# Altium schematic sheet 15-StimChannelSelection.SchDoc: Output Multiplexing
size A3; Date: 29/12/2023; DocumentNumber: 15; SheetNumber: 15; SheetTotal: 15
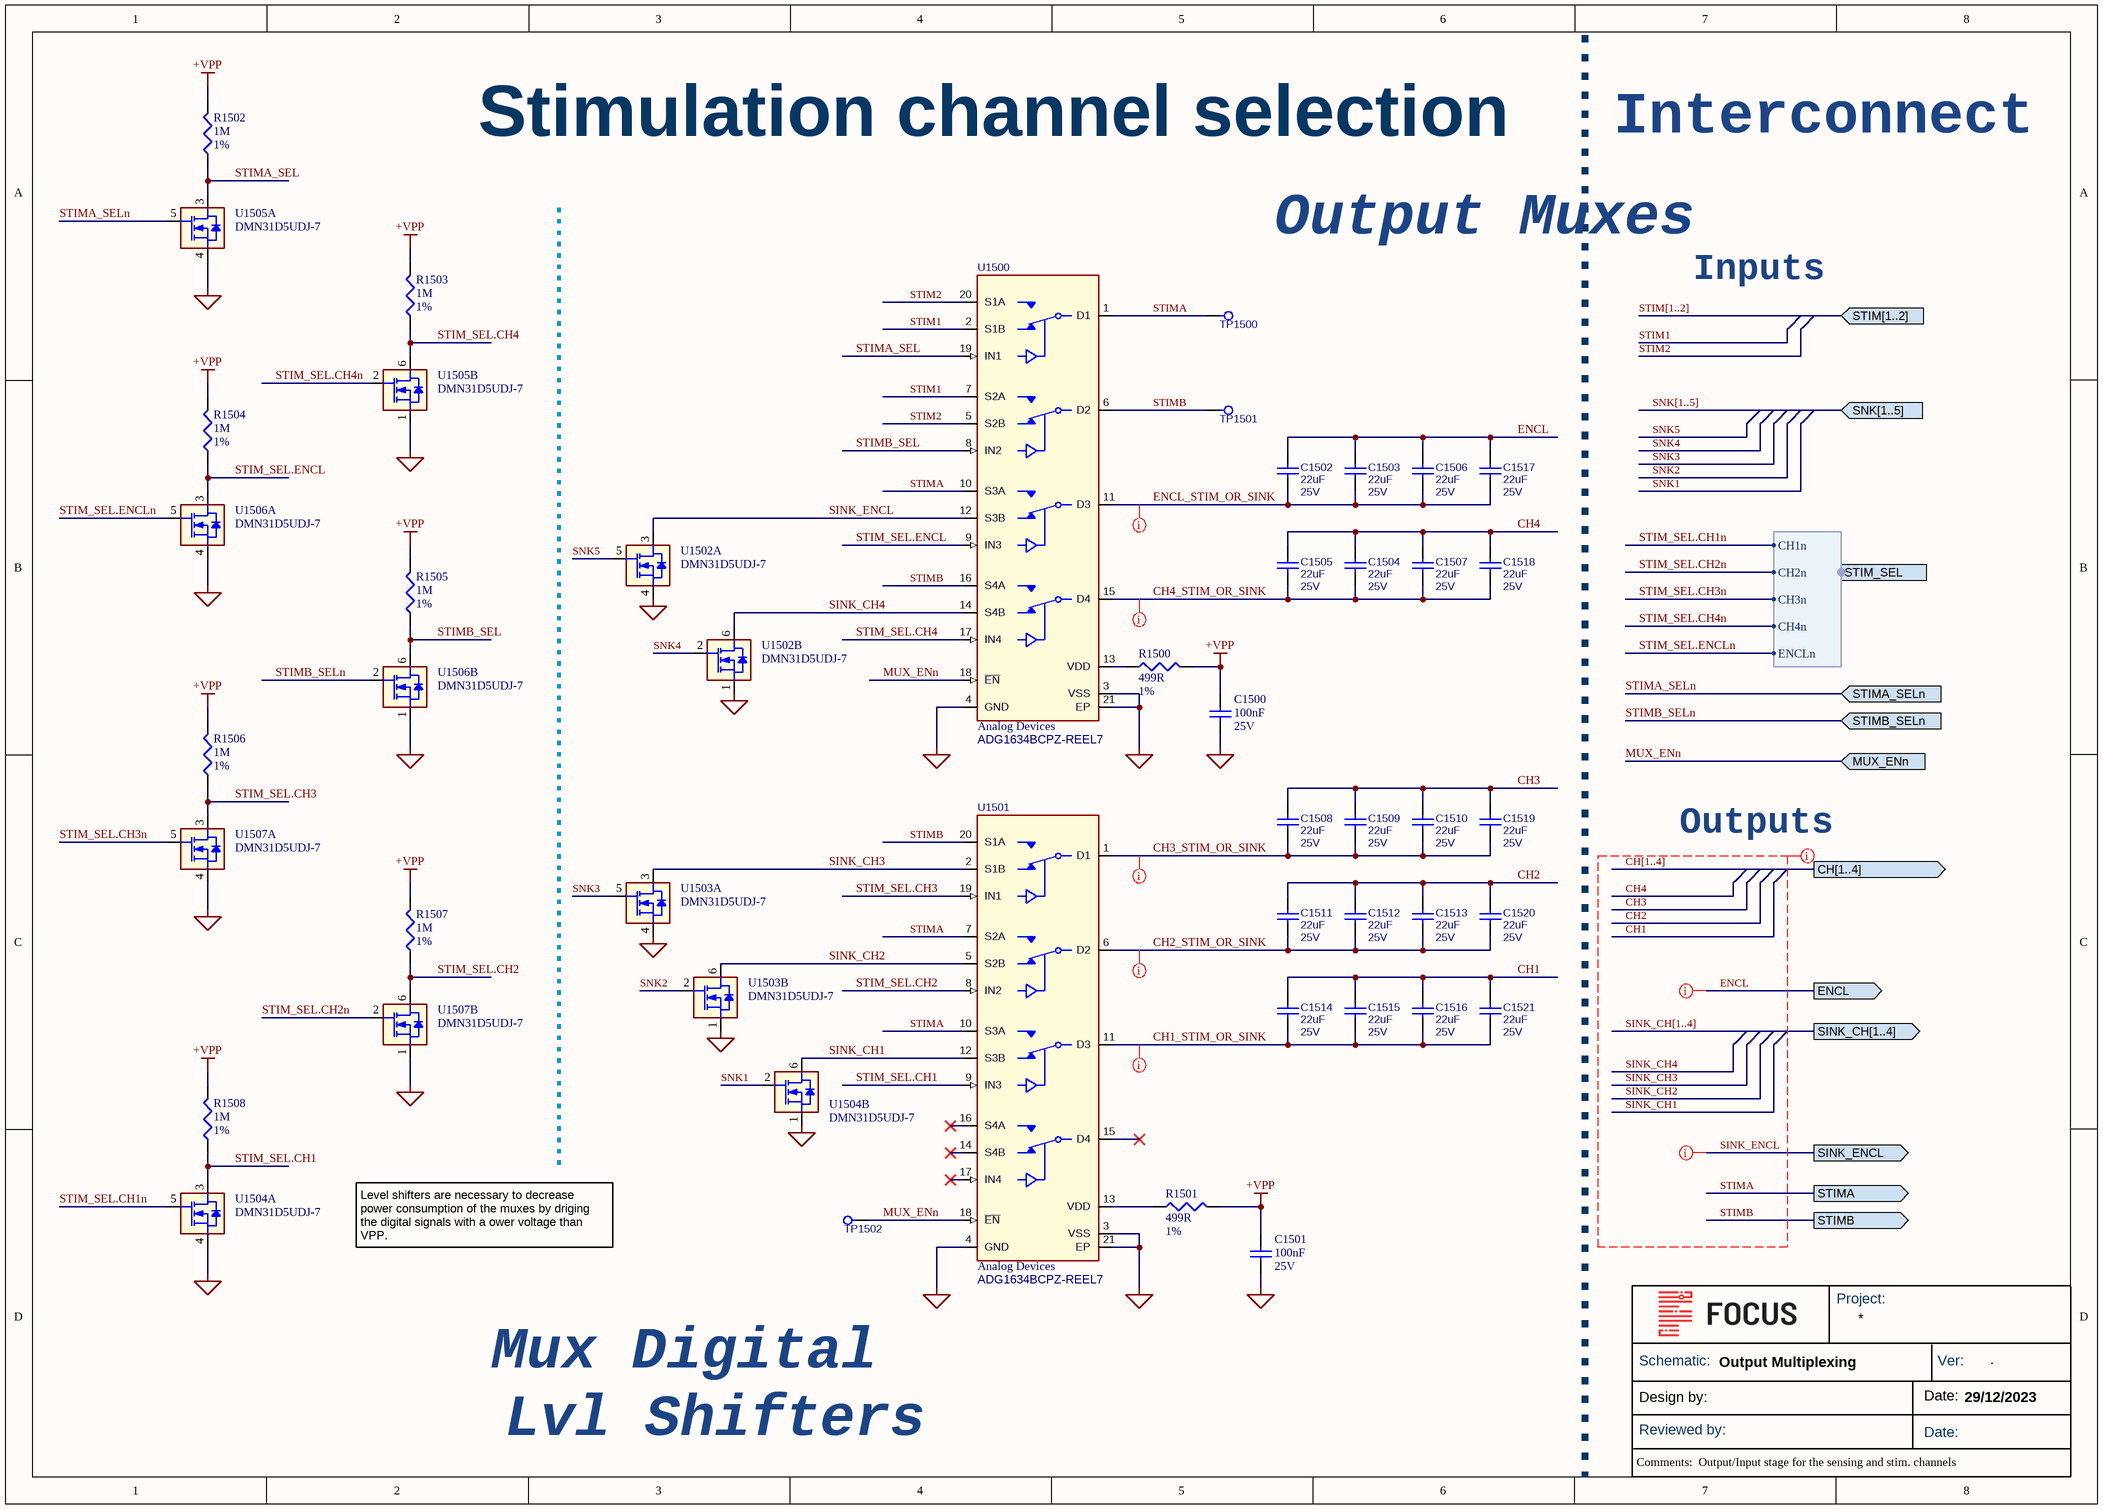
[diagram p0: 15-StimChannelSelection.SchDoc]

## Parts
C1500  value 100nF  Rated DC Voltage (URdc): 25V  [C0201_C]  (hidden comment: GRM033R61E104KE14J)
C1501  value 100nF  Rated DC Voltage (URdc): 25V  [C0201_C]  (hidden comment: GRM033R61E104KE14J)
C1502  value 22uF  Rating: 25V  [C0603]  (hidden comment: GRM188C61E226ME01J)
C1503  value 22uF  Rating: 25V  [C0603]  (hidden comment: GRM188C61E226ME01J)
C1504  value 22uF  Rating: 25V  [C0603]  (hidden comment: GRM188C61E226ME01J)
C1505  value 22uF  Rating: 25V  [C0603]  (hidden comment: GRM188C61E226ME01J)
C1506  value 22uF  Rating: 25V  [C0603]  (hidden comment: GRM188C61E226ME01J)
C1507  value 22uF  Rating: 25V  [C0603]  (hidden comment: GRM188C61E226ME01J)
C1508  value 22uF  Rating: 25V  [C0603]  (hidden comment: GRM188C61E226ME01J)
C1509  value 22uF  Rating: 25V  [C0603]  (hidden comment: GRM188C61E226ME01J)
C1510  value 22uF  Rating: 25V  [C0603]  (hidden comment: GRM188C61E226ME01J)
C1511  value 22uF  Rating: 25V  [C0603]  (hidden comment: GRM188C61E226ME01J)
C1512  value 22uF  Rating: 25V  [C0603]  (hidden comment: GRM188C61E226ME01J)
C1513  value 22uF  Rating: 25V  [C0603]  (hidden comment: GRM188C61E226ME01J)
C1514  value 22uF  Rating: 25V  [C0603]  (hidden comment: GRM188C61E226ME01J)
C1515  value 22uF  Rating: 25V  [C0603]  (hidden comment: GRM188C61E226ME01J)
C1516  value 22uF  Rating: 25V  [C0603]  (hidden comment: GRM188C61E226ME01J)
C1517  value 22uF  Rating: 25V  [C0603]  (hidden comment: GRM188C61E226ME01J)
C1518  value 22uF  Rating: 25V  [C0603]  (hidden comment: GRM188C61E226ME01J)
C1519  value 22uF  Rating: 25V  [C0603]  (hidden comment: GRM188C61E226ME01J)
C1520  value 22uF  Rating: 25V  [C0603]  (hidden comment: GRM188C61E226ME01J)
C1521  value 22uF  Rating: 25V  [C0603]  (hidden comment: GRM188C61E226ME01J)
R1500  value 499R  Tolerance: 1%  [RES0402_REDUCED]  (hidden comment: CRCW0402499RFKEDHP)
R1501  value 499R  Tolerance: 1%  [RES0402_REDUCED]  (hidden comment: CRCW0402499RFKEDHP)
R1502  value 1M  Tolerance: 1%  [R0201_C]  (hidden comment: CRCW02011M00FNED)
R1503  value 1M  Tolerance: 1%  [R0201_C]  (hidden comment: CRCW02011M00FNED)
R1504  value 1M  Tolerance: 1%  [R0201_C]  (hidden comment: CRCW02011M00FNED)
R1505  value 1M  Tolerance: 1%  [R0201_C]  (hidden comment: CRCW02011M00FNED)
R1506  value 1M  Tolerance: 1%  [R0201_C]  (hidden comment: CRCW02011M00FNED)
R1507  value 1M  Tolerance: 1%  [R0201_C]  (hidden comment: CRCW02011M00FNED)
R1508  value 1M  Tolerance: 1%  [R0201_C]  (hidden comment: CRCW02011M00FNED)
TP1500  Test Point  [testpad_0.9mm]  (value not drawn)  (no BOM)
TP1501  Test Point  [testpad_0.9mm]  (value not drawn)  (no BOM)
TP1502  Test Point  [testpad_0.9mm]  (value not drawn)  (no BOM)
U1500  Manufacturer: Analog Devices  [AD_CP-20-10]  (hidden comment: ADG1634BCPZ-REEL7)
U1501  Manufacturer: Analog Devices  [AD_CP-20-10]  (hidden comment: ADG1634BCPZ-REEL7)
U1502  DMN31D5UDJ-7  [DIODESINC_SOT-963-6]  (parts A,B of 2)
U1503  DMN31D5UDJ-7  [DIODESINC_SOT-963-6]  (parts A,B of 2)
U1504  DMN31D5UDJ-7  [DIODESINC_SOT-963-6]  (parts A,B of 2)
U1505  DMN31D5UDJ-7  [DIODESINC_SOT-963-6]  (parts A,B of 2)
U1506  DMN31D5UDJ-7  [DIODESINC_SOT-963-6]  (parts A,B of 2)
U1507  DMN31D5UDJ-7  [DIODESINC_SOT-963-6]  (parts A,B of 2)

## Ports
CH[1..4] (out), ENCL (out), MUX_ENn (in), SINK_CH[1..4] (out), SINK_ENCL (out), SNK[1..5] (in), STIM[1..2] (in), STIM_SEL (in, harness STIM_SEL), STIMA (out), STIMA_SELn (in), STIMB (out), STIMB_SELn (in)

## Harnesses
STIM_SEL: CH1n, CH2n, CH3n, CH4n, ENCLn

## Nets
+VPP: C1500.2 C1501.2 R1500.2 R1501.2 R1502.1 R1503.1 R1504.1 R1505.1 R1506.1 R1507.1 R1508.1
GND: C1500.1 C1501.1 U1500.3(VSS) U1500.4(GND) U1500.21(EP) U1501.3(VSS) U1501.4(GND) U1501.21(EP) U1502.1 U1502.4 U1503.1 U1503.4 U1504.1 U1504.4 U1505.1 U1505.4 U1506.1 U1506.4 U1507.1 U1507.4
CH1: C1514.1 C1515.1 C1516.1 C1521.1
CH1_STIM_OR_SINK: C1514.2 C1515.2 C1516.2 C1521.2 U1501.11(D3)
CH2: C1511.1 C1512.1 C1513.1 C1520.1
CH2_STIM_OR_SINK: C1511.2 C1512.2 C1513.2 C1520.2 U1501.6(D2)
CH3: C1508.1 C1509.1 C1510.1 C1519.1
CH3_STIM_OR_SINK: C1508.2 C1509.2 C1510.2 C1519.2 U1501.1(D1)
CH4: C1504.1 C1505.1 C1507.1 C1518.1
CH4_STIM_OR_SINK: C1504.2 C1505.2 C1507.2 C1518.2 U1500.15(D4)
ENCL: C1502.2 C1503.2 C1506.2 C1517.1 ; port ENCL
ENCL_STIM_OR_SINK: C1502.1 C1503.1 C1506.1 C1517.2 U1500.11(D3)
MUX_ENn: TP1502.1 U1500.18(~{EN}) U1501.18(~{EN}) ; port MUX_ENn
SINK_CH1: U1501.12(S3B) U1504.6
SINK_CH2: U1501.5(S2B) U1503.6
SINK_CH3: U1501.2(S1B) U1503.3
SINK_CH4: U1500.14(S4B) U1502.6
SINK_ENCL: U1500.12(S3B) U1502.3 ; port SINK_ENCL
SNK1: U1504.2
SNK2: U1503.2
SNK3: U1503.5
SNK4: U1502.2
SNK5: U1502.5
STIM1: U1500.2(S1B) U1500.7(S2A)
STIM2: U1500.5(S2B) U1500.20(S1A)
STIM_SEL.CH1: R1508.2 U1501.9(IN3) U1504.3
STIM_SEL.CH1n: U1504.5 ; port STIM_SEL.CH1n
STIM_SEL.CH2: R1507.2 U1501.8(IN2) U1507.6
STIM_SEL.CH2n: U1507.2 ; port STIM_SEL.CH2n
STIM_SEL.CH3: R1506.2 U1501.19(IN1) U1507.3
STIM_SEL.CH3n: U1507.5 ; port STIM_SEL.CH3n
STIM_SEL.CH4: R1503.2 U1500.17(IN4) U1505.6
STIM_SEL.CH4n: U1505.2 ; port STIM_SEL.CH4n
STIM_SEL.ENCL: R1504.2 U1500.9(IN3) U1506.3
STIM_SEL.ENCLn: U1506.5 ; port STIM_SEL.ENCLn
STIMA: TP1500.1 U1500.1(D1) U1500.10(S3A) U1501.7(S2A) U1501.10(S3A) ; port STIMA
STIMA_SEL: R1502.2 U1500.19(IN1) U1505.3
STIMA_SELn: U1505.5 ; port STIMA_SELn
STIMB: TP1501.1 U1500.6(D2) U1500.16(S4A) U1501.20(S1A) ; port STIMB
STIMB_SEL: R1505.2 U1500.8(IN2) U1506.6
STIMB_SELn: U1506.2 ; port STIMB_SELn
NetR1500_1: R1500.1 U1500.13(VDD)
NetR1501_1: R1501.1 U1501.13(VDD)

Not connected (* = marked no-connect by the designer): U1501 14(S4B)* 15(D4)* 16(S4A)* 17(IN4)*

## Buses and harness runs
bus CH[1..4] = port CH[1..4]
bus SINK_CH[1..4] = port SINK_CH[1..4]
bus SNK[1..5] = port SNK[1..5]
bus STIM[1..2] = port STIM[1..2]

## Layout directives
net class ANALOG: CH1, CH1_STIM_OR_SINK, CH2, CH2_STIM_OR_SINK, CH3, CH3_STIM_OR_SINK, CH4, CH4_STIM_OR_SINK, CH[1..4], ENCL, ENCL_STIM_OR_SINK, SINK_CH1, SINK_CH2, SINK_CH3, SINK_CH4, SINK_CH[1..4], SINK_ENCL, STIMA, STIMB

## Notes on the sheet
- Stimulation channel selection
- Interconnect
- Output Muxes
- Inputs
- Outputs
- Level shifters are necessary to decrease power consumption of the muxes by driging the digital signals with a ower voltage than VPP.
- Mux Digital
- Lvl Shifters
- Output/Input stage for the sensing and stim. channels
- Project:
- Schematic:
- Ver:
- .
- Design by:
- Reviewed by:
- Date:
- Comments:

## Library data of the parts
C1500 C1501 = GRM033R61E104KE14J: Ceramic Capacitor, Multilayer, Ceramic, 25V, 10% +Tol, 10% -Tol, X5R, 15% TC, 0.1uF, Surface Mount, 0201; Manufacturer: Murata; Multilayer: Yes; Supplier: Digikey; Supplier Part Number: 490-14571-1-ND; Manufacturer Part Number: GRM033R61E104KE14J; RoHS: Yes; Category: Ceramic Capacitors; Stock: 1540851; Pricing: 1=0,1, 10=0,033, 50=0,0192, 100=0,0148, 500=0,01118, 1000=0,00878, 2500=0,00798, 5000=0,00734 (USD); Mounting Technology: Surface Mount; Pins: 2; Dielectric Material: Ceramic; Package Shape: Rectangular; Case/Package: 0201; Terminal Finish: Nickel; Min Operating Temperature: -55°C; Max Operating Temperature: 85°C; JESD-609 Code: e3; Capacitor Type: Ceramic; Tolerance  (fill in as +-): 10%; Package Style: SMTMeter; Packaging: Tape and Reel; Tolerance (fill in as +-): 10%; Temperature Characteristics Code: X5R; Termination: Wraparound; Length: 0.6mm; Width: 0.3mm; Height: 0.3mm; Reach SVHC Compliant: Yes; RoHS Compliant: Yes; ComponentLink1URL: https://psearch.en.murata.com:443/capacitor/product/GRM033R61E104KE14%23.pdf?src-supplier=IHS+Markit; ComponentLink1Description: https://psearch.en.murata.com:443/capacitor/product/GRM033R61E104KE14%23.pdf?src-supplier=IHS+Markit; ComponentLink2URL: http://www.mouser.com/ds/2/281/c02e-2905.pdf?src-supplier=Mouser; ComponentLink2Description: http://www.mouser.com/ds/2/281/c02e-2905.pdf?src-supplier=Mouser; ComponentLink3URL: http://search.murata.co.jp/Ceramy/image/img/A01X/G101/ENG/GRM033R61E104KE14-01.pdf?src-supplier=Digikey; ComponentLink3Description: http://search.murata.co.jp/Ceramy/image/img/A01X/G101/ENG/GRM033R61E104KE14-01.pdf?src-supplier=Digikey; ComponentLink4URL: https://search.murata.co.jp/Ceramy/image/img/A01X/G101/ENG/GRM033R61E104KE14-01.pdf?src-supplier=Digikey; ComponentLink4Description: https://search.murata.co.jp/Ceramy/image/img/A01X/G101/ENG/GRM033R61E104KE14-01.pdf?src-supplier=Digikey; Supplier 1: Arrow Electronics; Supplier Part Number 1: GRM033R61E104KE14J
C1502-C1521 = GRM188C61E226ME01J: Capacitor, 22uF, X5S, 25V, 20%, 0603; Manufacturer: Murata; PCB Footprint: C0603_C; Review: 020823; Length (mm): 1.6mm; Manufacturer Part Number: GRM188C61E226ME01J; Medical Grade MFR: N/A; Medical Grade MFR PN: N/A; Thickness (mm): 0.8mm; Width (mm): 0.8mm; Category: Capacitor; Package Description: 0603; Status: Approved; Supplier 1: Mouser; Supplier Part Number 1: 81-GRM188C61E226ME1J; Supplier 2: Digikey; Supplier Part Number 2: 490-GRM188C61E226ME01JCT-ND; Supplier 3: Digikey; Supplier Part Number 3: 490-GRM188C61E226ME01JDKR-ND; Supplier 4: Digikey; Supplier Part Number 4: 490-GRM188C61E226ME01JTR-ND
R1500 R1501 = CRCW0402499RFKEDHP: Fixed Resistor, Metal Glaze/thick Film, 0.2W, 499ohm, 50V, 1% +/-Tol, 100ppm/Cel, Surface Mount, 0402; Manufacturer: Vishay Dale; Manufacturer Series: CRCW-HPE3; Medical Grade MFR: TBD; Power: 200mW; Rated Temperature: 70°C; Temperature Coefficient: 100ppm/°C; Package Height: 0.3mm; Package Length: 1mm; Package Width: 0.5mm; Reference Standard: AEC-Q200; Supplier: Digikey; Supplier Part Number: 541-499YCT-ND; Manufacturer Part Number: CRCW0402499RFKEDHP; RoHS: Yes; Category: Chip SMD Resistors; Stock: 50100; Pricing: 1=0.13, 10=0.061, 50=0.0402, 100=0.0341, 500=0.024, 1000=0.02091, 5000=0.01572 (USD); Mounting Technology: Surface Mount; Pins: 2; Package Shape: Rectangular; Case/Package: 0402; Terminal Finish: Nickel; Min Operating Temperature: -55°C; Max Operating Temperature: 155°C; JESD-609 Code: e3; Resistor Type: FIXED RESISTOR; Construction: Chip; Package Style: SMTMeter; Packaging: Tape and Reel; Series: CRCW-HP E3; Technology: METAL GLAZE/THICK FILM; Termination: Wraparound; Working Voltage: 50V; Reach SVHC Compliant: Yes; RoHS Compliant: Yes; ComponentLink1URL: https://datasheet.ciiva.com:443/pdfs/VipMasterIC/IC/VISH/VISH-S-A0009391795/VISH-S-A0009391795-1.pdf?src-supplier=IHS+Markit; ComponentLink1Description: https://datasheet.ciiva.com:443/pdfs/VipMasterIC/IC/VISH/VISH-S-A0009391795/VISH-S-A0009391795-1.pdf?src-supplier=IHS+Markit; ComponentLink2URL: https://datasheet.ciiva.com/5540/crcwhpe3-46056-5540816.pdf?src-supplier=Mouser; ComponentLink2Description: https://datasheet.ciiva.com/5540/crcwhpe3-46056-5540816.pdf?src-supplier=Mouser; ComponentLink3URL: https://datasheet.ciiva.com/8932/crcwhpe3-8932421.pdf?src-supplier=Avnet; ComponentLink3Description: https://datasheet.ciiva.com/8932/crcwhpe3-8932421.pdf?src-supplier=Avnet; Supplier 1: Mouser; Supplier Part Number 1: 71-CRCW0402499RFKEDH; Medical Grade MFR PN: TBD
R1502-R1508 = CRCW02011M00FNED: Fixed Resistor, Metal Glaze/thick Film, 0.05W, 1000000ohm, 30V, 1% +/-Tol, 200ppm/Cel, Surface Mount, 0201; Manufacturer: Vishay; Medical Grade MFR: Mini-Systems; Medical Grade MFR PN: MWA96SM-1004F-NS62TR; Power: 50mW; Rated Temperature: 70°C; Temperature Coefficient: 200ppm/°C; Package Height: 0.23mm; Package Length: 0.6mm; Package Width: 0.3mm; Reference Standard: AEC-Q200; Supplier: Digikey; Supplier Part Number: 541-1.00MABCT-ND; Manufacturer Part Number: CRCW02011M00FNED; RoHS: Yes; Category: Chip SMD Resistors; Stock: 392914; Pricing: 1=0,1, 10=0,037, 50=0,0242, 100=0,0204, 500=0,01426, 1000=0,01241, 5000=0,00924 (USD); Mounting Technology: Surface Mount; Pins: 2; Package Shape: Rectangular; Case/Package: 0201; Terminal Finish: Nickel; Min Operating Temperature: -55°C; Max Operating Temperature: 155°C; JESD-609 Code: e3; Resistor Type: FIXED RESISTOR; Construction: Chip; Package Style: SMTMeter; Packaging: Tape and Reel; Technology: METAL GLAZE/THICK FILM; Termination: Wraparound; Working Voltage: 30V; Reach SVHC Compliant: Yes; RoHS Compliant: Yes; ComponentLink1URL: https://datasheet.ciiva.com:443/pdfs/VipMasterIC/IC/VISH/VISH-S-A0002932828/VISH-S-A0002932828-1.pdf?src-supplier=IHS+Markit; ComponentLink1Description: https://datasheet.ciiva.com:443/pdfs/VipMasterIC/IC/VISH/VISH-S-A0002932828/VISH-S-A0002932828-1.pdf?src-supplier=IHS+Markit; ComponentLink2URL: https://datasheet.ciiva.com/7841/1719906-7841438.pdf?src-supplier=Element14; ComponentLink2Description: https://datasheet.ciiva.com/7841/1719906-7841438.pdf?src-supplier=Element14; ComponentLink3URL: https://datasheet.ciiva.com/7841/1719906-7841439.pdf?src-supplier=Element14; ComponentLink3Description: https://datasheet.ciiva.com/7841/1719906-7841439.pdf?src-supplier=Element14; ComponentLink4URL: https://datasheet.ciiva.com/7859/dcrcwe3-7859689.pdf?src-supplier=Element14; ComponentLink4Description: https://datasheet.ciiva.com/7859/dcrcwe3-7859689.pdf?src-supplier=Element14; ComponentLink5URL: https://datasheet.ciiva.com/16757/70202042-16757675.pdf?src-supplier=Allied+Electronics; ComponentLink5Description: https://datasheet.ciiva.com/16757/70202042-16757675.pdf?src-supplier=Allied+Electronics; ComponentLink6URL: https://datasheet.ciiva.com/22692/1719906-22692761.pdf?src-supplier=Element14; ComponentLink6Description: https://datasheet.ciiva.com/22692/1719906-22692761.pdf?src-supplier=Element14; ComponentLink7URL: https://datasheet.ciiva.com/9109/crcw0201e3-9109910.pdf?src-supplier=Avnet; ComponentLink7Description: https://datasheet.ciiva.com/9109/crcw0201e3-9109910.pdf?src-supplier=Avnet; ComponentLink8URL: https://datasheet.ciiva.com/22675/1847332-22675065.pdf?src-supplier=Element14; ComponentLink8Description: https://datasheet.ciiva.com/22675/1847332-22675065.pdf?src-supplier=Element14; ComponentLink9URL: https://datasheet.ciiva.com/2474/crcw0201e3-2474824.pdf?src-supplier=Digikey; ComponentLink9Description: https://datasheet.ciiva.com/2474/crcw0201e3-2474824.pdf?src-supplier=Digikey; ComponentLink10URL: https://datasheet.ciiva.com/2474/crcw0201e3-2474825.pdf?src-supplier=Digikey; ComponentLink10Description: https://datasheet.ciiva.com/2474/crcw0201e3-2474825.pdf?src-supplier=Digikey; ComponentLink11URL: https://datasheet.ciiva.com/2474/crcw0201e3-2474826.pdf?src-supplier=Digikey; ComponentLink11Description: https://datasheet.ciiva.com/2474/crcw0201e3-2474826.pdf?src-supplier=Digikey; Supplier 1: Digikey; Supplier Part Number 1: 541-1.00MABCT-ND
TP1500-TP1502 = Test Point: Test pad, 0.90mm circular pad; PCB Footprint: testpad_0p90mm; Length (mm): 0.90; Manufacturer: N/A; Manufacturer PN: N/A; Medical Grade MFR: N/A; Medical Grade MFR PN: N/A; Rating: N/A; Thickness (mm): N/A; Value: Test point; Width (mm): 0.90; Category: Test point; Status: *; Review: *
U1500 U1501 = ADG1634BCPZ-REEL7: IC SWITCH SPDTX4 4.5OHM 20LFCSP; PCB Footprint: TBD; Category: IC; Length (mm): 4.00 ±0.10; Manufacturer Part Number: ADG1634BCPZ-REEL7; Medical Grade MFR: N/A; Medical Grade MFR PN: N/A; Rating: TBD; Thickness (mm): 0.75 ±0.05; Width (mm): 4.00 ±0.10; Package Description: TBD; Supplier 1: Digi-Key; Supplier Part Number 1: 505-ADG1634BCPZ-REEL7CT-ND; Status: *; Review: *; Value: ADG1634BCPZ-REEL7
U1502-U1507 = DMN31D5UDJ-7: MOSFET 2N-CH 30V 0.22A SOT963; Manufacturer: Diodes inc.; Number of Channels: 2; Power Dissipation: 350mW; Id(Max): 220mA; Vgs(Max): ±12V; Vth(Max): 1.0V; Ron(Max): 4.5Ohm; Cin: 22.6pF; Manufacturer Part Number: DMN31D5UDJ-7; Category: Transistors; Vds(Max): 30V; Type: MOSFET array; RoHs: RoHS 2; Package: SOT-963; Supplier 1: Digikey; Supplier Part Number 1: 31-DMN31D5UDJ-7CT-ND